# Altium project e-puck3-coreboard.PrjPcb (part 3 of 4)

## Sheet Main_uC.SchDoc: Main microcontroller
size A3; Organization: Use Organization_Name in ProjParam; Address1: Eliot Ferragni; Address2: STI-MOBOTS; Address3: EPFL; Address4: CH-1015 LAUSANNE; DocumentNumber: 2; Revision: A; SheetNumber: 2; SheetTotal: 11; ApprovedBy: Init ApprovedBy in DocParam; CheckedBy: Init CheckedBy in DocParam; Author: Init Author in DocParam; CompanyName: Init CompanyName in DocParam; DrawnBy: Init DrawBy in DocParam; Engineer: Init Engineer in DocParam; Title2: Main microcontroller + user's buttons; DocumentName: Init DocumentName in DocParam; ProjectName: Init ProjectName in DocParam
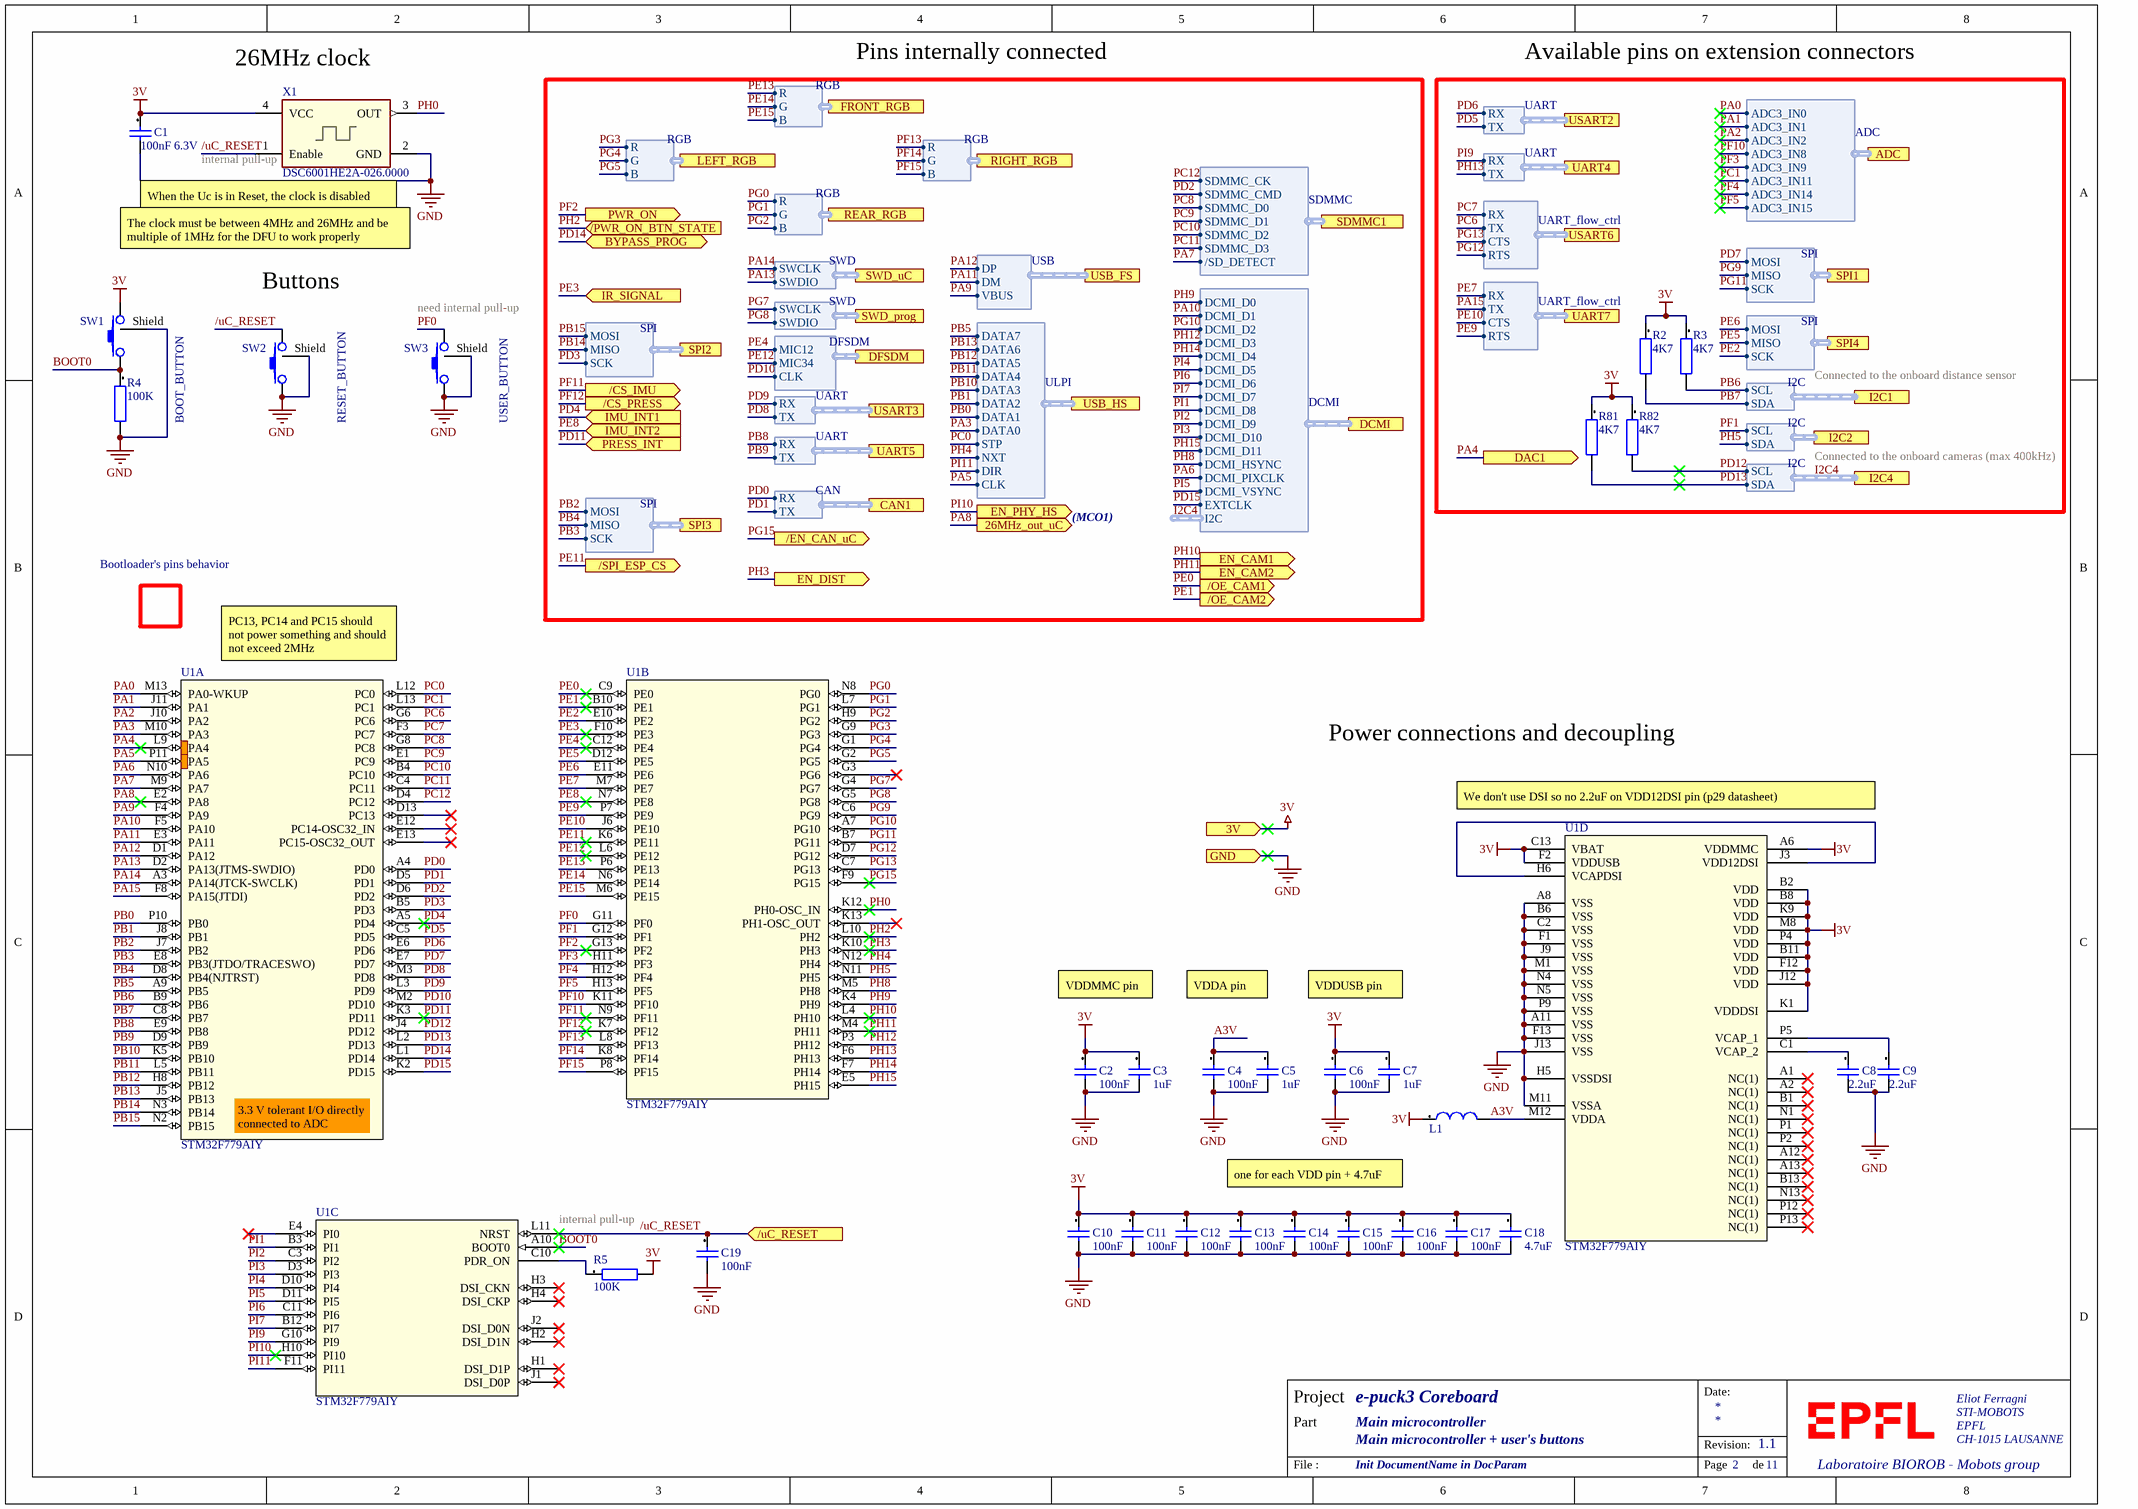
[diagram p7: Main_uC.SchDoc]

### Parts
(Parts that share a designator on the sheet are numbered #1, #2 ... from top to bottom, then left to right.)
C1  100nF 6.3V  [CAPC0201(0603)33_L]
C2  100nF  [CAPC0201(0603)33_L]
C3  1uF  [CAPC0201(0603)33_L]
C4  100nF  [CAPC0201(0603)33_L]
C5  1uF  [CAPC0201(0603)33_L]
C6  100nF  [CAPC0201(0603)33_L]
C7  1uF  [CAPC0201(0603)33_L]
C8  2.2uF  [CAPC0201(0603)33_L]
C9  2.2uF  [CAPC0201(0603)33_L]
C10  100nF  [CAPC0201(0603)33_L]
C11  100nF  [CAPC0201(0603)33_L]
C12  100nF  [CAPC0201(0603)33_L]
C13  100nF  [CAPC0201(0603)33_L]
C14  100nF  [CAPC0201(0603)33_L]
C15  100nF  [CAPC0201(0603)33_L]
C16  100nF  [CAPC0201(0603)33_L]
C17  100nF  [CAPC0201(0603)33_L]
C18  4.7uF  [CAPC0201(0603)33_L]
C19  100nF  [CAPC0201(0603)33_L]
L1  MMZ1005S601HT000  [0402 inductor]  (value not drawn)
R2  4K7  [RESC0201(0603)_L]
R3  4K7  [RESC0201(0603)_L]
R4  100K  [RESC0201(0603)_L]
R5#2  100K  [RESC0201(0603)_L]
R81  4K7  [RESC0201(0603)_L]
R82#2  4K7  [RESC0201(0603)_L]
SW1  button  [C&K_KMR2]  (value not drawn)
SW2  button  [C&K_KMR2]  (value not drawn)
SW3  button  [C&K_KMR2]  (value not drawn)
U1  STM32F779AIY  [WLCSP-180]  (parts A,B,C,D of 4)
X1  DSC6001HE2A-026.0000  [Oscillator 1.6x1.2mm VFLGA]

### Blocks framed on the sheet
Available pins on extension connectors: R2 R3 R81 R82#2

### Ports
3V (in), 26MHz_out_uC (out), /CS_IMU (out), /CS_PRESS (out), /EN_CAN_uC (out), /OE_CAM1 (out), /OE_CAM2 (out), /PWR_ON_BTN_STATE (in), /SPI_ESP_CS (out), /uC_RESET (in), ADC (harness ADC), BYPASS_PROG (bidir), CAN1 (harness CAN), DAC1 (out), DCMI (harness DCMI), DFSDM (harness DFSDM), EN_CAM1 (out), EN_CAM2 (out), EN_DIST (out), EN_PHY_HS (out), FRONT_RGB (harness RGB), GND (in), I2C1 (harness I2C), I2C2 (harness I2C), I2C4 (harness I2C), IMU_INT1 (in), IMU_INT2 (in), IR_SIGNAL (in), LEFT_RGB (harness RGB), PRESS_INT (in), PWR_ON (out), REAR_RGB (harness RGB), RIGHT_RGB (harness RGB), SDMMC1 (harness SDMMC), SPI1 (harness SPI), SPI2 (harness SPI), SPI3 (harness SPI), SPI4 (harness SPI), SWD_prog (harness SWD), SWD_uC (harness SWD), UART4 (harness UART), UART5 (harness UART), UART7 (harness UART_flow_ctrl), USART2 (harness UART), USART3 (harness UART), USART6 (harness UART_flow_ctrl), USB_FS (harness USB), USB_HS (harness ULPI)

### Harnesses
SWD: SWDIO, SWCLK
I2C: SDA, SCL
CAN: TX, RX
USB: DM, DP, VBUS
UART: RX, TX
RGB: R, G, B
DFSDM: MIC34, MIC12, CLK
DCMI: DCMI_D0, DCMI_D1, DCMI_D2, DCMI_D3, DCMI_D4, DCMI_D5, DCMI_D6, DCMI_D7, DCMI_D8, DCMI_D9, DCMI_D10, DCMI_D11, DCMI_HSYNC, DCMI_PIXCLK, DCMI_VSYNC, I2C, EXTCLK
SDMMC: SDMMC_CK, SDMMC_CMD, SDMMC_D0, SDMMC_D1, SDMMC_D2, SDMMC_D3, /SD_DETECT
SPI: MISO, MOSI, SCK
UART_flow_ctrl: RX, TX, CTS, RTS
ADC: ADC3_IN0, ADC3_IN1, ADC3_IN2, ADC3_IN8, ADC3_IN9, ADC3_IN11, ADC3_IN14, ADC3_IN15
ULPI: DATA7, DATA6, DATA5, DATA4, DATA3, DATA2, DATA1, DATA0, STP, NXT, DIR, CLK

### Nets
3V: C1.1 C2.1 C3.1 C6.1 C7.1 C10.1 C11.1 C12.1 C13.1 C14.1 C15.1 C16.1 C17.1 C18.1 L1.1 R2.1 R3.1 R5#2.2 R81.1 R82#2.1 SW1.2 U1.A6(VDDMMC) U1.B2(VDD) U1.B8(VDD) U1.B11(VDD) U1.C13(VBAT) U1.F2(VDDUSB) U1.F12(VDD) U1.J12(VDD) U1.K1(VDDDSI) U1.K9(VDD) U1.M8(VDD) U1.P4(VDD) X1.4(VCC) ; port 3V
GND: C1.2 C2.2 C3.2 C4.2 C5.2 C6.2 C7.2 C8.2 C9.2 C10.2 C11.2 C12.2 C13.2 C14.2 C15.2 C16.2 C17.2 C18.2 C19.2 R4.2 SW1.Shield SW2.1 SW2.Shield SW3.1 SW3.Shield U1.A8(VSS) U1.A11(VSS) U1.B6(VSS) U1.C2(VSS) U1.F1(VSS) U1.F13(VSS) U1.H5(VSSDSI) U1.J9(VSS) U1.J13(VSS) U1.M1(VSS) U1.M11(VSSA) U1.N4(VSS) U1.N5(VSS) U1.P9(VSS) X1.2(GND) ; port GND
/uC_RESET: C19.1 SW2.2 U1.L11(NRST) X1.1(Enable) ; port /uC_RESET
A3V: C4.1 C5.1 L1.2 U1.M12(VDDA)  [project net A3V_2]
BOOT0: R4.1 SW1.1 U1.A10(BOOT0)  [project net BOOT0_2]
PA0: U1.M13(PA0-WKUP) ; port ADC.ADC3_IN0  [project net ADC.ADC3_IN0]
PA1: U1.J11(PA1) ; port ADC.ADC3_IN1  [project net ADC.ADC3_IN1]
PA2: U1.J10(PA2) ; port ADC.ADC3_IN2  [project net ADC.ADC3_IN2]
PA3: U1.M10(PA3) ; port USB_HS.DATA0  [project net USB_HS.DATA0]
PA4: U1.L9(PA4) ; port DAC1  [project net DAC1]
PA5: U1.P11(PA5) ; port USB_HS.CLK  [project net USB_HS.CLK]
PA6: U1.N10(PA6) ; port DCMI.DCMI_PIXCLK  [project net DCMI.DCMI_PIXCLK]
PA7: U1.M9(PA7) ; port SDMMC1./SD_DETECT  [project net SDMMC./SD_DETECT]
PA8: U1.E2(PA8) ; port 26MHz_out_uC  [project net 26MHz_PHY_HS]
PA9: U1.F4(PA9) ; port USB_FS.VBUS  [project net USB_FS.VBUS]
PA10: U1.F5(PA10) ; port DCMI.DCMI_D1  [project net DCMI.DCMI_D1]
PA11: U1.E3(PA11) ; port USB_FS.DM  [project net USB_FS.DM]
PA12: U1.D1(PA12) ; port USB_FS.DP  [project net USB_FS.DP]
PA13: U1.D2(PA13(JTMS-SWDIO)) ; port SWD_uC.SWDIO  [project net SWD_uC.SWDIO]
PA14: U1.A3(PA14(JTCK-SWCLK)) ; port SWD_uC.SWCLK  [project net SWD_uC.SWCLK]
PA15: U1.F8(PA15(JTDI)) ; port UART7.TX  [project net UART7.TX]
PB0: U1.P10(PB0) ; port USB_HS.DATA1  [project net USB_HS.DATA1]
PB1: U1.J8(PB1) ; port USB_HS.DATA2  [project net USB_HS.DATA2]
PB2: U1.J7(PB2) ; port SPI3.MOSI  [project net SPI3.MOSI]
PB3: U1.E8(PB3(JTDO/TRACESWO)) ; port SPI3.SCK  [project net SPI3.SCK]
PB4: U1.D8(PB4(NJTRST)) ; port SPI3.MISO  [project net SPI3.MISO]
PB5: U1.A9(PB5) ; port USB_HS.DATA7  [project net USB_HS.DATA7]
PB6: R3.2 U1.B9(PB6) ; port I2C1.SCL  [project net I2C1.SCL]
PB7: R2.2 U1.C8(PB7) ; port I2C1.SDA  [project net I2C1.SDA]
PB8: U1.E9(PB8) ; port UART5.RX  [project net UART5_uC.RX]
PB9: U1.D9(PB9) ; port UART5.TX  [project net UART2_ESP32.RX]
PB10: U1.K5(PB10) ; port USB_HS.DATA3  [project net USB_HS.DATA3]
PB11: U1.L5(PB11) ; port USB_HS.DATA4  [project net USB_HS.DATA4]
PB12: U1.H8(PB12) ; port USB_HS.DATA5  [project net USB_HS.DATA5]
PB13: U1.J5(PB13) ; port USB_HS.DATA6  [project net USB_HS.DATA6]
PB14: U1.N3(PB14) ; port SPI2.MISO  [project net SPI2.MISO]
PB15: U1.N2(PB15) ; port SPI2.MOSI  [project net SPI2.MOSI]
PC0: U1.L12(PC0) ; port USB_HS.STP  [project net USB_HS.STP]
PC1: U1.L13(PC1) ; port ADC.ADC3_IN11  [project net ADC.ADC3_IN11]
PC6: U1.G6(PC6) ; port USART6.TX  [project net USART6.TX]
PC7: U1.F3(PC7) ; port USART6.RX  [project net USART6.RX]
PC8: U1.G8(PC8) ; port SDMMC1.SDMMC_D0  [project net SDMMC.SDMMC_D0]
PC9: U1.E1(PC9) ; port SDMMC1.SDMMC_D1  [project net SDMMC.SDMMC_D1]
PC10: U1.B4(PC10) ; port SDMMC1.SDMMC_D2  [project net SDMMC.SDMMC_D2]
PC11: U1.C4(PC11) ; port SDMMC1.SDMMC_D3  [project net SDMMC.SDMMC_D3]
PC12: U1.D4(PC12) ; port SDMMC1.SDMMC_CK  [project net SDMMC.SDMMC_CK]
PD0: U1.A4(PD0) ; port CAN1.RX  [project net CAN1.RX]
PD1: U1.D5(PD1) ; port CAN1.TX  [project net CAN1.TX]
PD2: U1.D6(PD2) ; port SDMMC1.SDMMC_CMD  [project net SDMMC.SDMMC_CMD]
PD3: U1.B5(PD3) ; port SPI2.SCK  [project net SPI2.SCK]
PD4: U1.A5(PD4) ; port IMU_INT1  [project net IMU_INT1]
PD5: U1.C5(PD5) ; port USART2.TX  [project net USART2.TX]
PD6: U1.E6(PD6) ; port USART2.RX  [project net USART2.RX]
PD7: U1.E7(PD7) ; port SPI1.MOSI  [project net SPI1.MOSI]
PD8: U1.M3(PD8) ; port USART3.TX  [project net USART3.TX]
PD9: U1.L3(PD9) ; port USART3.RX  [project net USART3.RX]
PD10: U1.M2(PD10) ; port DFSDM.CLK  [project net DFSDM.CLK]
PD11: U1.K3(PD11) ; port PRESS_INT  [project net PRESS_INT]
PD12: R82#2.2 U1.J4(PD12) ; port I2C4.SCL  [project net I2C4.SCL]
PD13: R81.2 U1.L2(PD13) ; port I2C4.SDA  [project net I2C4.SDA]
PD14: U1.L1(PD14) ; port BYPASS_PROG  [project net BYPASS_PROG]
PD15: U1.K2(PD15) ; port DCMI.EXTCLK  [project net DCMI.EXTCLK]
PE0: U1.C9(PE0) ; port /OE_CAM1  [project net /OE_CAM1]
PE1: U1.B10(PE1) ; port /OE_CAM2  [project net /OE_CAM2]
PE2: U1.E10(PE2) ; port SPI4.SCK  [project net SPI1.SCK]
PE3: U1.F10(PE3) ; port IR_SIGNAL  [project net IR_SIGNAL]
PE4: U1.C12(PE4) ; port DFSDM.MIC12  [project net DFSDM.MIC12]
PE5: U1.D12(PE5) ; port SPI4.MISO  [project net SPI1.MISO]
PE6: U1.E11(PE6) ; port SPI4.MOSI  [project net SPI1.MOSI]
PE7: U1.M7(PE7) ; port UART7.RX  [project net UART7.RX]
PE8: U1.N7(PE8) ; port IMU_INT2  [project net IMU_INT2]
PE9: U1.P7(PE9) ; port UART7.RTS  [project net UART7.RTS]
PE10: U1.J6(PE10) ; port UART7.CTS  [project net UART7.CTS]
PE11: U1.K6(PE11) ; port /SPI_ESP_CS  [project net /SPI_ESP_CS]
PE12: U1.L6(PE12) ; port DFSDM.MIC34  [project net DFSDM.MIC34]
PE13: U1.P6(PE13) ; port FRONT_RGB.R  [project net FRONT_RGB.R]
PE14: U1.N6(PE14) ; port FRONT_RGB.G  [project net FRONT_RGB.G]
PE15: U1.M6(PE15) ; port FRONT_RGB.B  [project net FRONT_RGB.B]
PF0: SW3.2 U1.G11(PF0)  [project net PF0_2]
PF1: U1.G12(PF1) ; port I2C2.SCL  [project net I2C2.SCL]
PF2: U1.G13(PF2) ; port PWR_ON  [project net PWR_ON]
PF3: U1.H11(PF3) ; port ADC.ADC3_IN9  [project net ADC.ADC3_IN9]
PF4: U1.H12(PF4) ; port ADC.ADC3_IN14  [project net ADC.ADC3_IN14]
PF5: U1.H13(PF5) ; port ADC.ADC3_IN15  [project net ADC.ADC3_IN15]
PF10: U1.K11(PF10) ; port ADC.ADC3_IN8  [project net ADC.ADC3_IN8]
PF11: U1.N9(PF11) ; port /CS_IMU  [project net /CS_IMU]
PF12: U1.K7(PF12) ; port /CS_PRESS  [project net /CS_PRESS]
PF13: U1.L8(PF13) ; port RIGHT_RGB.R  [project net RIGHT_RGB.R]
PF14: U1.K8(PF14) ; port RIGHT_RGB.G  [project net RIGHT_RGB.G]
PF15: U1.P8(PF15) ; port RIGHT_RGB.B  [project net RIGHT_RGB.B]
PG0: U1.N8(PG0) ; port REAR_RGB.R  [project net REAR_RGB.R]
PG1: U1.L7(PG1) ; port REAR_RGB.G  [project net REAR_RGB.G]
PG2: U1.H9(PG2) ; port REAR_RGB.B  [project net REAR_RGB.B]
PG3: U1.G9(PG3) ; port LEFT_RGB.R  [project net LEFT_RGB.R]
PG4: U1.G1(PG4) ; port LEFT_RGB.G  [project net LEFT_RGB.G]
PG5: U1.G2(PG5) ; port LEFT_RGB.B  [project net LEFT_RGB.B]
PG7: U1.G4(PG7) ; port SWD_prog.SWCLK  [project net SWD_prog.SWCLK]
PG8: U1.G5(PG8) ; port SWD_prog.SWDIO  [project net SWD_prog.SWDIO]
PG9: U1.C6(PG9) ; port SPI1.MISO  [project net SPI1.MISO]
PG10: U1.A7(PG10) ; port DCMI.DCMI_D2  [project net DCMI.DCMI_D2]
PG11: U1.B7(PG11) ; port SPI1.SCK  [project net SPI1.SCK]
PG12: U1.D7(PG12) ; port USART6.RTS  [project net USART6.RTS]
PG13: U1.C7(PG13) ; port USART6.CTS  [project net USART6.CTS]
PG15: U1.F9(PG15) ; port /EN_CAN_uC  [project net /EN_CAN_uC]
PH0: U1.K12(PH0-OSC_IN) X1.3(OUT)  [project net PH0_2]
PH2: U1.L10(PH2) ; port /PWR_ON_BTN_STATE  [project net /PWR_ON_BTN_STATE]
PH3: U1.K10(PH3) ; port EN_DIST  [project net EN_DIST]
PH4: U1.N12(PH4) ; port USB_HS.NXT  [project net USB_HS.NXT]
PH5: U1.N11(PH5) ; port I2C2.SDA  [project net I2C2.SDA]
PH8: U1.M5(PH8) ; port DCMI.DCMI_HSYNC  [project net DCMI.DCMI_HSYNC]
PH9: U1.K4(PH9) ; port DCMI.DCMI_D0  [project net DCMI.DCMI_D0]
PH10: U1.L4(PH10) ; port EN_CAM1  [project net EN_CAM1]
PH11: U1.M4(PH11) ; port EN_CAM2  [project net EN_CAM2]
PH12: U1.P3(PH12) ; port DCMI.DCMI_D3  [project net DCMI.DCMI_D3]
PH13: U1.F6(PH13) ; port UART4.TX  [project net UART4.TX]
PH14: U1.F7(PH14) ; port DCMI.DCMI_D4  [project net DCMI.DCMI_D4]
PH15: U1.E5(PH15) ; port DCMI.DCMI_D11  [project net DCMI.DCMI_D11]
PI1: U1.B3(PI1) ; port DCMI.DCMI_D8  [project net DCMI.DCMI_D8]
PI2: U1.C3(PI2) ; port DCMI.DCMI_D9  [project net DCMI.DCMI_D9]
PI3: U1.D3(PI3) ; port DCMI.DCMI_D10  [project net DCMI.DCMI_D10]
PI4: U1.D10(PI4) ; port DCMI.DCMI_D5  [project net DCMI.DCMI_D5]
PI5: U1.D11(PI5) ; port DCMI.DCMI_VSYNC  [project net DCMI.DCMI_VSYNC]
PI6: U1.C11(PI6) ; port DCMI.DCMI_D6  [project net DCMI.DCMI_D6]
PI7: U1.B12(PI7) ; port DCMI.DCMI_D7  [project net DCMI.DCMI_D7]
PI9: U1.G10(PI9) ; port UART4.RX  [project net UART4.RX]
PI10: U1.H10(PI10) ; port EN_PHY_HS  [project net /EN_PHY_HS]
PI11: U1.F11(PI11) ; port USB_HS.DIR  [project net USB_HS.DIR]
NetC8_1: C8.1 U1.C1(VCAP_2)
NetC9_1: C9.1 U1.P5(VCAP_1)
NetR5#2_1: R5#2.1 U1.C10(PDR_ON)
NetU1_H6: U1.H6(VCAPDSI) U1.J3(VDD12DSI)

Not connected (* = marked no-connect by the designer): U1 A1(NC(1))* A2(NC(1))* A12(NC(1))* A13(NC(1))* B1(NC(1))* B13(NC(1))* D13(PC13)* E4(PI0)* E12(PC14-OSC32_IN)* E13(PC15-OSC32_OUT)* G3(PG6)* H1(DSI_D1P)* H2(DSI_D1N)* H3(DSI_CKN)* H4(DSI_CKP)* J1(DSI_D0P)* J2(DSI_D0N)* K13(PH1-OSC_OUT)* N1(NC(1))* N13(NC(1))* P1(NC(1))* P2(NC(1))* P12(NC(1))* P13(NC(1))*

### Buses and harness runs
harness I2C4 = port I2C4

### Notes on the sheet
- (near X1) 26MHz clock
- Pins internally connected
- (near X1) internal pull-up
- The clock must be between 4MHz and 26MHz and be multiple of 1MHz for the DFU to work properly
- When the Uc is in Reset, the clock is disabled
- (near SW2) Buttons
- (near SW3) need internal pull-up
- Connected to the onboard distance sensor
- BOOT_BUTTON
- RESET_BUTTON
- USER_BUTTON
- Connected to the onboard cameras (max 400kHz)
- Bootloader's pins behavior
- (MCO1)
- (near U1) PC13, PC14 and PC15 should not power something and should not exceed 2MHz
- Power connections and decoupling
- (near U1) We don't use DSI so no 2.2uF on VDD12DSI pin (p29 datasheet)
- VDDMMC pin
- VDDA pin
- VDDUSB pin
- (near U1) Bootloader's pins behavior :
  USART1 :
  PA10 (RX) set as input 		-> connected to DCMI_D1						=> OK
  PA9 (TX) set as output high		-> connected to VBUS_DEVICES					=> problem if VBUS_DEVICES is low -> Serial Resistance
  USART3:
  PB11 (RX) set as input		-> connected to ULPI_D4						=> OK because the HS Phy is turned OFF if we are in the BOOTLOADER (pins are in Tri-State)
  PB10 (TX) set as output high		-> connected to ULPI_D3						=> OK because the HS Phy is turned OFF if we are in the BOOTLOADER (pins are in Tri-State)
  PC11 (RX) set as input		-> connected to SDMMC_D3						=> OK (sd card can connect it to VCC with a 50k resistor)
  PC10 (TX) set as output high		-> connected to SDMMC_D2						=> OK (sd card is input floating unless a SET_BUS_WIDTH is received)
  CAN2 (slave):
  PB5 (RX) set as input			-> connected to ULPI_D7						=> OK
  PB13 (TX) set as output high		-> connected to ULPI_D6						=> OK because the HS Phy is turned OFF if we are in the BOOTLOADER (pins are in Tri-State)
  I2C1 (slave):
  PB6 (SCL) set as open-drain		-> connected to I2C1 SCL						=> OK
  PB9 (SDA) set as open-drain		-> connected to UART5 TX						=> OK
  I2C2 (slave):
  PF1 (SCL) set as open-drain		-> connected to I2C2 SCL						=> OK
  PF0 (SDA) set as open-drain		-> connected to USER_BUTTON					=> OK
  I2C3 (slave):
  PA8 (SCL) set as open-drain		-> connected to REFCLK of HS Phy					=> OK
  PC9 (SDA) set as open-drain		-> connected to SDMMC_D1						=> OK
  SPI1 (slave):
  PA7 (MOSI) set as input pull-down	-> connected to SDMMC_DET						=> OK
  PA6 (MISO) set as output pull-down	-> connected to DCMI_PIXCLK						=> OK because camera is off if we are in BOOTLOADER
  PA5 (SCK) set as input pull-down	-> connected to ULPI_CK						=> OK (pull-down is around 40k)
  PA4 (NSS) set as input pull-up		-> connected to DAC_OUT1						=> OK
  SPI2 (slave):
  PI3 (MOSI) set as input pull-down	-> connected to DCMI_D10						=> OK (pull-down is around 40k)
  PI2 (MISO) set as output pull-down	-> connected to DCMI_D9						=> OK because camera is off if we are in BOOTLOADER
  PI1 (SCK) set as input pull-down		-> connected to DCMI_D8						=> OK (pull-down is around 40k)
  PI0 (NSS) set as input pull-up		-> connected to DCMI_D13						=> OK (pull-up is around 40k)
  SPI4 (slave):
  PE14 (MOSI) set as input pull-down	-> connected FRONT_RGB_G						=> OK
  PE13 (MISO) set as output pull-down	-> connected FRONT_RGB_R						=> OK
  PE12 (SCK) set as input pull-down	-> connected to MIC34						=> OK because the microphones won't send anything if not clocked
  PE11 (NSS) set as input pull-up		-> connected to /SPI_ESP_CS						=> OK
  USB (DFU):
  PA11 (DM)			-> connected to DM of the USB hub					=> OK
  PA12 (DP) (no pull-up needed)		-> connected to DP of the USB hub					=> OK
- one for each VDD pin + 4.7uF
- internal pull-up
- Date:
- Project
- Part
- Revision:
- File :
- Page
- de
- (in symbol STM32F77XAXY, part A) 3.3 V tolerant I/O directly connected to ADC

### Library data of the parts
C1-C19 = TBD Capacitor[[/\]]0201[[/\]]1: as C67-C82 on sheet Sensors + CAN; Size: 0201; Footprint Acort: 0201; ROHS: True; DateLastUpdate: 2018-10-19 / 8:59:52 AM; Manufacturer: -; Manufacturer part number: -; Package / Case: Capacitor 0201
L1 = MMZ1005S601HT000: FERRITE BEAD 600 OHM 0402 1LN; Manufacturer: TDK; Type: SMD; Note: To buy by assembler; Supplier 1: Digi-Key; Stock 1: 33440; Pricing 1: 1 = 0,10000, 10 = 0,07300, 25 = 0,06600, 50 = 0,05940, 100 = 0,04360, 250 = 0,03168, 500 = 0,02904, 1000 = 0,02508, 5000 = 0,01980 (USD); RoHS: No; ComponentLink1URL: https://product.tdk.com/info/en/catalog/datasheets/beads_commercial_signal_mmz1005-h_en.pdf?src-supplier=Digi-Key; ComponentLink1Description: https://product.tdk.com/info/en/catalog/datasheets/beads_commercial_signal_mmz1005-h_en.pdf?src-supplier=Digi-Key; Supplier Part Number 1: 445-175172-1-ND; Manufacturer Part Number: MMZ1005S601HT000; Package / Case: Ferrite bead 0402
R2-R4 R5#2 R81 R82#2 = TBD[[/\]]0201[[/\]]1: Resistor 0201; Preference: 1; Currentie: CHF; Note: To buy by assembler; Size: 0201; Footprint Acort: 0201; ROHS: True; DateLastUpdate: 2018-10-19 / 9:06:49 AM; Type: SMD; Manufacturer: -; Manufacturer part number: -; Package / Case: Resistor 0201
SW1-SW3 = C&K KMR2: KMR221GLFS; Manufacturer: C&K; Manufacturer Nr: 7-188275-6; Preference: 1; Currentie: CHF; Quant_1: 10; Quant_2: 900; Circuit: SPST-NO; Switch Function: Off-Mom; Contact Rating @ Voltage: 0.05A @ 32VDC; Actuator Type: Standard; Actuator Height off PCB, from Pins: 1.90mm; Actuator Orientation: Top Actuated; Outline: 4.60mm x 2.80mm; Illumination: Non-Illuminated; Operating Force: 200gf; Switch Travel: 0.25mm; Mechanical Life: 200,000 Cycles; Note: To buy by assembler; Footprint Acort: ToDefine; ComponentLink1Description: Datasheet; ComponentLink1URL: http://ecommas.tycoelectronics.com/commerce/DocumentDelivery/DDEController?Action=showdoc&DocId=Customer+Drawing%7F188275%7FR%7Fpdf%7FEnglish%7FC_188275_R.pdf; Supplier: Farnell; Supplier Nr: 1056234; ComponentLink2Description: Farnell link; ComponentLink2URL: http://fr.farnell.com/jsp/displayProduct.jsp?sku=1056234; ROHS: True; Type: SMD; Orientation: Vertical; DateLastUpdate: 2007-12-04 / 09:15:57; Price_1: 1,1; Price_2: 0,924; Supplier 1: Digi-Key; Manufacturer Part Number: KMR221GLFS; Category: Switches; Stock 1: 20549; Pricing 1: 1=0.51, 10=0.493, 25=0.484, 50=0.4656, 100=0.4017, 250=0.3652, 500=0.34694, 1000=0.2739 (USD); Packaging: Cut Tape (CT); Mounting Type: Surface Mount; Termination Style: Gull Wing; Illumination Voltage (Nominal): -; Illumination Type, Color: -; Ingress Protection: -; Features: Grounding Pin; Actuator Material: -; Operating Temperature: -40°C ~ 85°C; ComponentLink3URL: http://www.ck-components.com/index.php?module=media&action=Display&cmpref=14414&lang=en&width=&height=&format=&alt=; ComponentLink3Description: http://www.ck-components.com/index.php?module=media&action=Display&cmpref=14414&lang=en&width=&height=&format=&alt=; Supplier Part Number 1: 401-1427-1-ND; Package / Case: SMD Button
U1 = STM32F77XAXY: High Performance 32bits microcontroler; Vendor: STMicroelectronics; C: Copyright (C) 2016 Accelerated Designs. All rights reserved; Note: To buy by assembler; Manufacturer_Part_Number: stm32f779aiy; Copyright: Copyright (C) 2016 Accelerated Designs. All rights reserved; RefDes: RefDes; Type: SMD; Value: Value; Manufacturer: STMicroelectronics; Manufacturer part number: STM32F779AIY; Package / Case: WLCSP-180
X1 = DSC6001HE2A-026.0000: 26MHz LVCMOS MEMS (Silicon) Oscillator  1.71 V ~ 3.63 V Enable/Disable; Manufacturer: Microchip; Note: To buy by assembler; Supplier 1: Digi-Key; Stock 1: 797; Pricing 1: 1 = 1,07000, 25 = 0,89600, 100 = 0,81370 (USD); RoHS: No; Supplier Part Number 1: DSC6001HE2A-026.0000-ND; Manufacturer Part Number: DSC6001HE2A-026.0000; Type: SMD; Package / Case: VFLGA-4

## Sheet Extension_Connectors.SchDoc: Extensions connectors
size A3; Organization: Use Organization_Name in ProjParam; Address1: Eliot Ferragni; Address2: STI-MOBOTS; Address3: EPFL; Address4: CH-1015 LAUSANNE; DocumentNumber: 11; Revision: A; SheetNumber: 11; SheetTotal: 11; ApprovedBy: Init ApprovedBy in DocParam; CheckedBy: Init CheckedBy in DocParam; Author: Init Author in DocParam; CompanyName: Init CompanyName in DocParam; DrawnBy: Init DrawBy in DocParam; Engineer: Init Engineer in DocParam; Title2: Top and bottom extension connectors; DocumentName: Init DocumentName in DocParam; ProjectName: Init ProjectName in DocParam
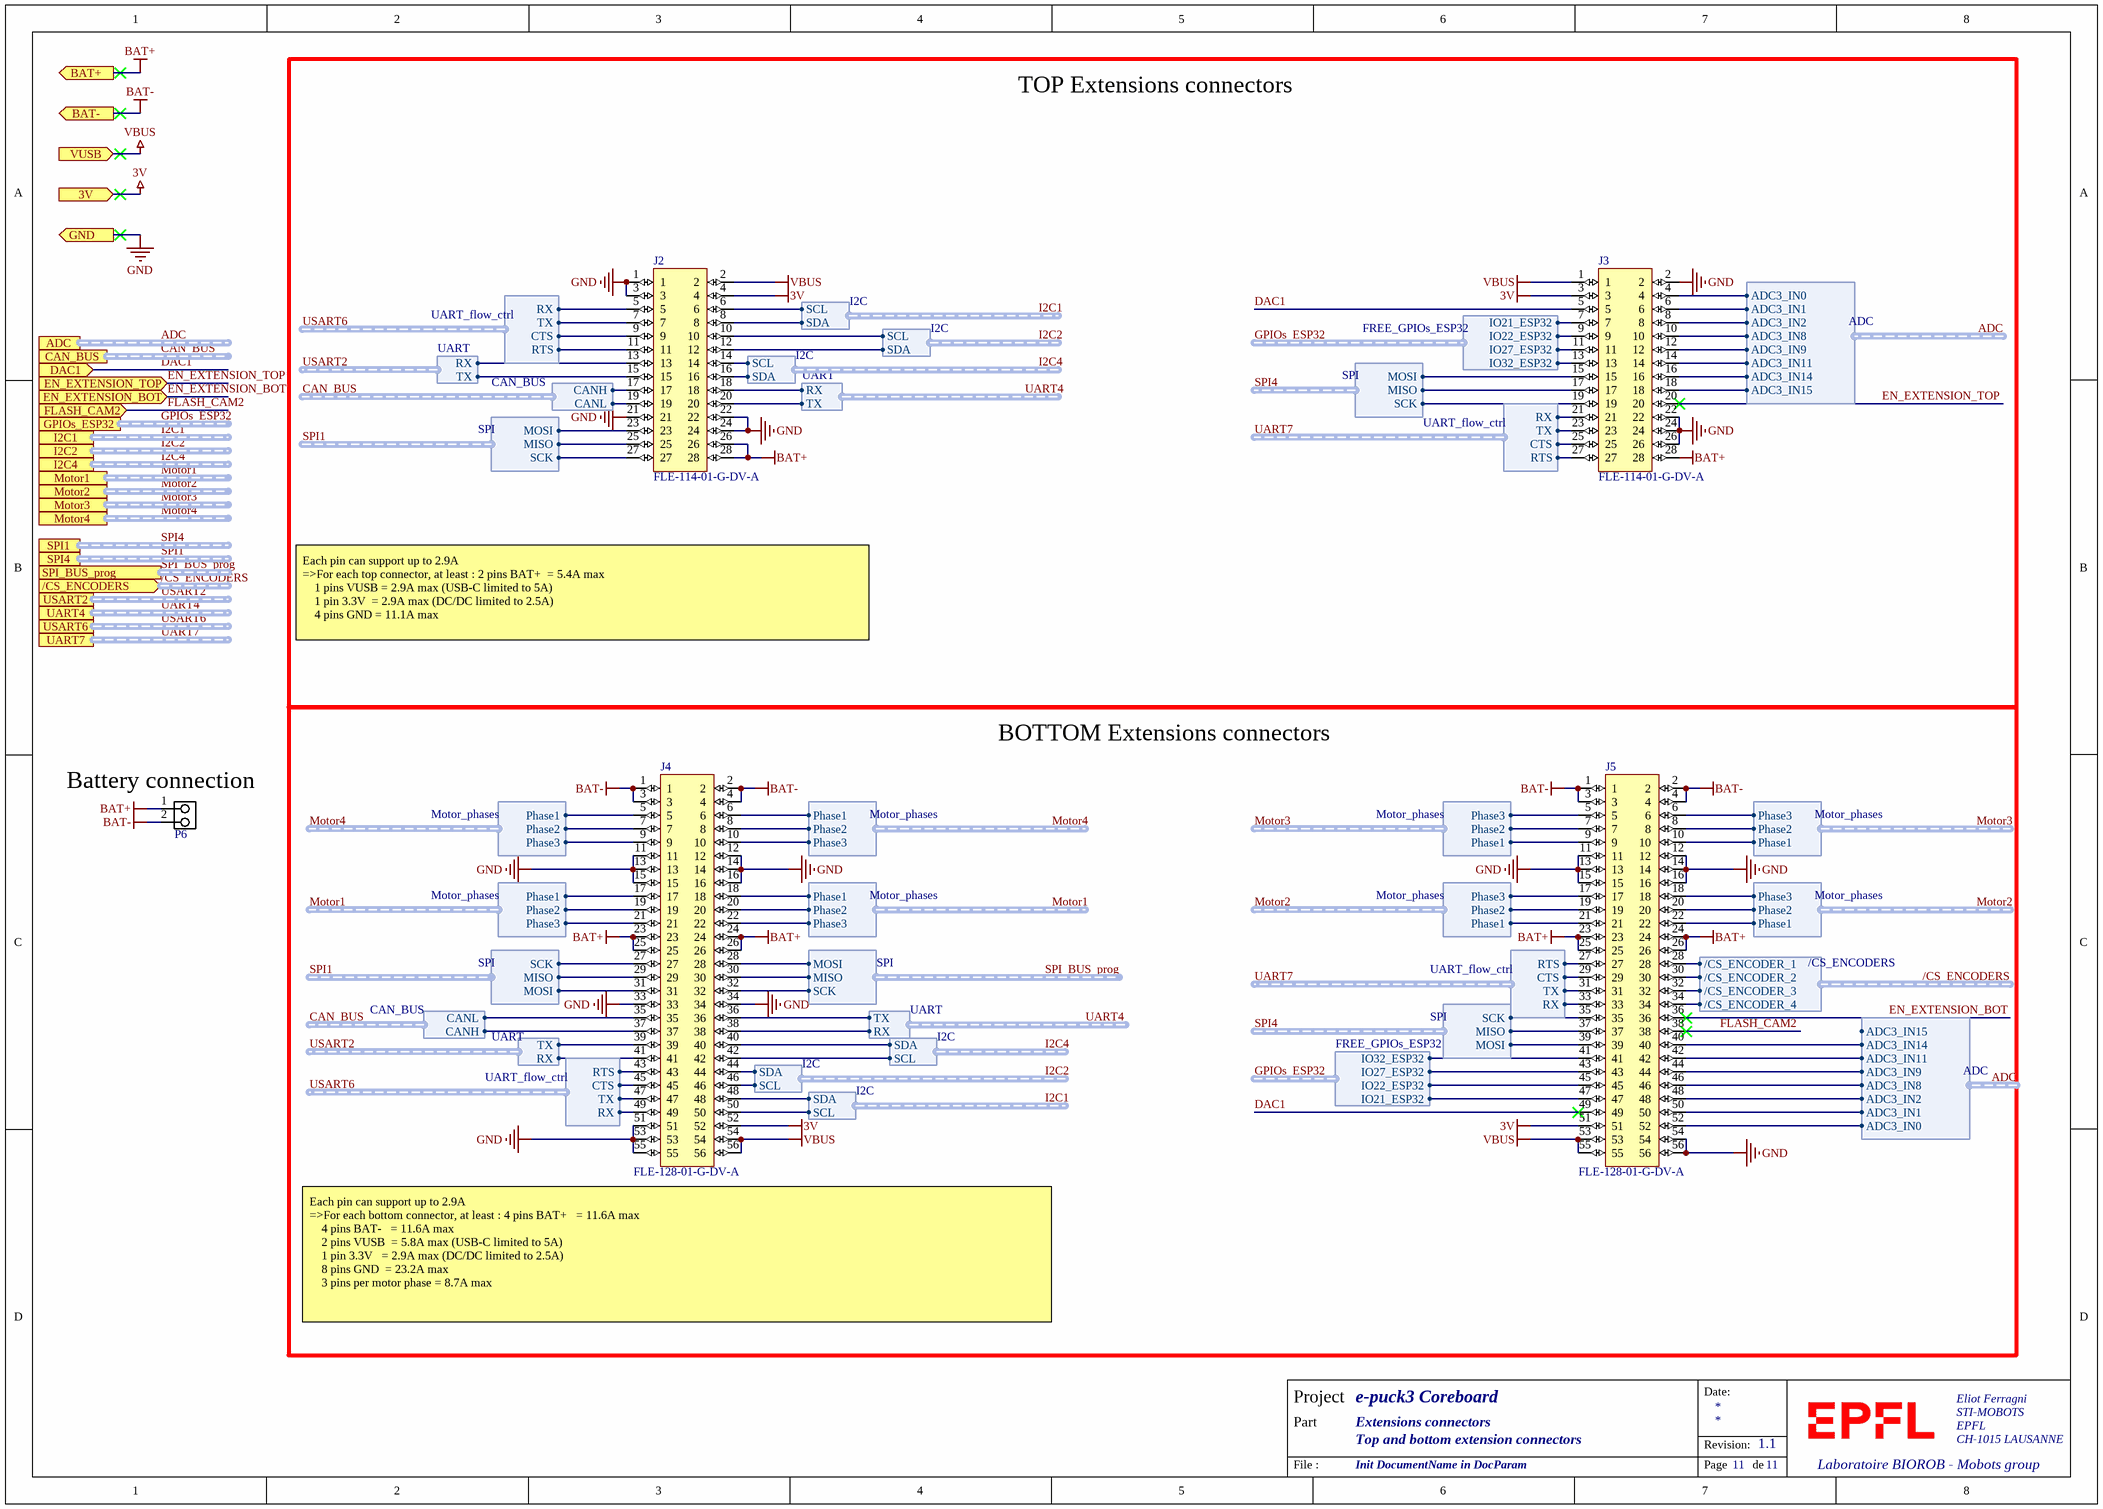
[diagram p8: Extension_Connectors.SchDoc]

### Parts
J2  FLE-114-01-G-DV-A  [FLE-114-01-G-DV-A]
J3  FLE-114-01-G-DV-A  [FLE-114-01-G-DV-A]
J4  FLE-128-01-G-DV-A  [FLE-128-01-G-DV-A]
J5  FLE-128-01-G-DV-A  [FLE-128-01-G-DV-A]
P6  2 power vias  [POWERVIAS_2]  (value not drawn)  (no BOM)

### Blocks framed on the sheet
TOP Extensions connectors: J2 J3
BOTTOM Extensions connectors: J4 J5

### Ports
3V (in), /CS_ENCODERS (in, harness /CS_ENCODERS), ADC (harness ADC), BAT+ (out), BAT- (out), CAN_BUS (harness CAN_BUS), DAC1 (in), EN_EXTENSION_BOT (in), EN_EXTENSION_TOP (in), FLASH_CAM2 (in), GND (out), GPIOs_ESP32 (harness FREE_GPIOs_ESP32), I2C1 (harness I2C), I2C2 (harness I2C), I2C4 (harness I2C), Motor1 (harness Motor_phases), Motor2 (harness Motor_phases), Motor3 (harness Motor_phases), Motor4 (harness Motor_phases), SPI1 (harness SPI), SPI4 (harness SPI), SPI_BUS_prog (harness SPI), UART4 (harness UART), UART7 (harness UART_flow_ctrl), USART2 (harness UART), USART6 (harness UART_flow_ctrl), VUSB (in)

### Harnesses
I2C: SDA, SCL
SPI: MISO, MOSI, SCK
UART_flow_ctrl: RX, TX, CTS, RTS
ADC: ADC3_IN0, ADC3_IN1, ADC3_IN2, ADC3_IN8, ADC3_IN9, ADC3_IN11, ADC3_IN14, ADC3_IN15
UART: RX, TX
CAN_BUS: CANL, CANH
/CS_ENCODERS: /CS_ENCODER_1, /CS_ENCODER_2, /CS_ENCODER_3, /CS_ENCODER_4
Motor_phases: Phase1, Phase2, Phase3
FREE_GPIOs_ESP32: IO22_ESP32, IO21_ESP32, IO27_ESP32, IO32_ESP32

### Nets
3V: J2.4 J3.3 J4.52 J5.51 ; port 3V
BAT+: J2.26 J2.28 J3.28 J4.23 J4.24 J4.25 J4.26 J5.23 J5.24 J5.25 J5.26 P6.1 ; port BAT+
BAT-: J4.1 J4.2 J4.3 J4.4 J5.1 J5.2 J5.3 J5.4 P6.2 ; port BAT-
GND: J2.1 J2.3 J2.21 J2.22 J2.24 J3.2 J3.22 J3.24 J3.26 J4.11 J4.12 J4.13 J4.14 J4.15 J4.16 J4.33 J4.34 J4.51 J4.53 J4.55 J5.11 J5.12 J5.13 J5.14 J5.15 J5.16 J5.54 J5.56 ; port GND
VBUS: J2.2 J3.1 J4.54 J4.56 J5.53 J5.55 ; port VUSB
/CS_ENCODERS./CS_ENCODER_1: J5.28 ; port /CS_ENCODERS./CS_ENCODER_1
/CS_ENCODERS./CS_ENCODER_2: J5.30 ; port /CS_ENCODERS./CS_ENCODER_2
/CS_ENCODERS./CS_ENCODER_3: J5.32 ; port /CS_ENCODERS./CS_ENCODER_3
/CS_ENCODERS./CS_ENCODER_4: J5.34 ; port /CS_ENCODERS./CS_ENCODER_4
ADC.ADC3_IN0: J3.4 J5.52 ; port ADC.ADC3_IN0
ADC.ADC3_IN1: J3.6 J5.50 ; port ADC.ADC3_IN1
ADC.ADC3_IN2: J3.8 J5.48 ; port ADC.ADC3_IN2
ADC.ADC3_IN8: J3.10 J5.46 ; port ADC.ADC3_IN8
ADC.ADC3_IN9: J3.12 J5.44 ; port ADC.ADC3_IN9
ADC.ADC3_IN11: J3.14 J5.42 ; port ADC.ADC3_IN11
ADC.ADC3_IN14: J3.16 J5.40 ; port ADC.ADC3_IN14
ADC.ADC3_IN15: J3.18 ; port ADC.ADC3_IN15
CAN_BUS.CANH: J2.17 J4.37 ; port CAN_BUS.CANH
CAN_BUS.CANL: J2.19 J4.35 ; port CAN_BUS.CANL
DAC1: J3.5 J5.49 ; port DAC1
EN_EXTENSION_BOT: J5.36 ; port EN_EXTENSION_BOT
EN_EXTENSION_TOP: J3.20 ; port EN_EXTENSION_TOP
FLASH_CAM2: J5.38 ; port FLASH_CAM2
FREE_GPIOs_ESP32.IO21_ESP32: J3.7 J5.47 ; port GPIOs_ESP32.IO21_ESP32
FREE_GPIOs_ESP32.IO22_ESP32: J3.9 J5.45 ; port GPIOs_ESP32.IO22_ESP32
FREE_GPIOs_ESP32.IO27_ESP32: J3.11 J5.43 ; port GPIOs_ESP32.IO27_ESP32
FREE_GPIOs_ESP32.IO32_ESP32: J3.13 J5.41 ; port GPIOs_ESP32.IO32_ESP32
I2C1.SCL: J2.6 J4.50 ; port I2C1.SCL
I2C1.SDA: J2.8 J4.48 ; port I2C1.SDA
I2C2.SCL: J2.10 J4.46 ; port I2C2.SCL
I2C2.SDA: J2.12 J4.44 ; port I2C2.SDA
I2C4.SCL: J2.14 J4.42 ; port I2C4.SCL
I2C4.SDA: J2.16 J4.40 ; port I2C4.SDA
Motor1.Phase1: J4.17 J4.18 ; port Motor1.Phase1
Motor1.Phase2: J4.19 J4.20 ; port Motor1.Phase2
Motor1.Phase3: J4.21 J4.22 ; port Motor1.Phase3
Motor2.Phase1: J5.21 J5.22 ; port Motor2.Phase1
Motor2.Phase2: J5.19 J5.20 ; port Motor2.Phase2
Motor2.Phase3: J5.17 J5.18 ; port Motor2.Phase3
Motor3.Phase1: J5.9 J5.10 ; port Motor3.Phase1
Motor3.Phase2: J5.7 J5.8 ; port Motor3.Phase2
Motor3.Phase3: J5.5 J5.6 ; port Motor3.Phase3
Motor4.Phase1: J4.5 J4.6 ; port Motor4.Phase1
Motor4.Phase2: J4.7 J4.8 ; port Motor4.Phase2
Motor4.Phase3: J4.9 J4.10 ; port Motor4.Phase3
SPI1.MISO: J2.25 J4.29 ; port SPI4.MISO
SPI1.MISO: J3.17 J5.37 ; port SPI1.MISO  [a separate net that carries the same name]
SPI1.MOSI: J3.15 J5.39 ; port SPI1.MOSI
SPI1.MOSI: J2.23 J4.31 ; port SPI4.MOSI  [a separate net that carries the same name]
SPI1.SCK: J2.27 J4.27 ; port SPI4.SCK
SPI1.SCK: J3.19 J5.35 ; port SPI1.SCK  [a separate net that carries the same name]
SPI_BUS.MISO: J4.30 ; port SPI_BUS_prog.MISO
SPI_BUS.MOSI: J4.28 ; port SPI_BUS_prog.MOSI
SPI_BUS.SCK: J4.32 ; port SPI_BUS_prog.SCK
UART4.RX: J2.18 J4.38 ; port UART4.RX
UART4.TX: J2.20 J4.36 ; port UART4.TX
UART7.CTS: J3.25 J5.29 ; port UART7.CTS
UART7.RTS: J3.27 J5.27 ; port UART7.RTS
UART7.RX: J3.21 J5.33 ; port UART7.RX
UART7.TX: J3.23 J5.31 ; port UART7.TX
USART2.RX: J2.13 J4.41 ; port USART2.RX
USART2.TX: J2.15 J4.39 ; port USART2.TX
USART6.CTS: J2.9 J4.45 ; port USART6.CTS
USART6.RTS: J2.11 J4.43 ; port USART6.RTS
USART6.RX: J2.5 J4.49 ; port USART6.RX
USART6.TX: J2.7 J4.47 ; port USART6.TX

### Buses and harness runs
harness /CS_ENCODERS = port /CS_ENCODERS
harness ADC = port ADC
harness CAN_BUS = port CAN_BUS
harness GPIOs_ESP32 = port GPIOs_ESP32
harness I2C1 = port I2C1
harness I2C2 = port I2C2
harness I2C4 = port I2C4
harness Motor1 = port Motor1
harness Motor2 = port Motor2
harness Motor3 = port Motor3
harness Motor4 = port Motor4
harness SPI1 = port SPI4
harness SPI4 = port SPI1
harness SPI_BUS_prog = port SPI_BUS_prog
harness UART4 = port UART4
harness UART7 = port UART7
harness USART2 = port USART2
harness USART6 = port USART6

### Notes on the sheet
- Each pin can support up to 2.9A
  =>For each top connector, at least :	2 pins BAT+ 	= 5.4A max
  1 pins VUSB	= 2.9A max (USB-C limited to 5A)
  1 pin 3.3V		= 2.9A max (DC/DC limited to 2.5A)
  4 pins GND	= 11.1A max
- (near P6) Battery connection
- (near J4) Each pin can support up to 2.9A
  =>For each bottom connector, at least :	4 pins BAT+ 		= 11.6A max
  4 pins BAT- 		= 11.6A max
  2 pins VUSB		= 5.8A max (USB-C limited to 5A)
  1 pin 3.3V			= 2.9A max (DC/DC limited to 2.5A)
  8 pins GND		= 23.2A max
  3 pins per motor phase	= 8.7A max
- Date:
- Project
- Part
- Revision:
- File :
- Page
- de

### Library data of the parts
J2 J3 = FLE-114-01-G-DV-A: .050 MICRO STRIPS; Manufacturer: Samtec; Number of Contacts: 28; Gender: Female; Pitch: 1.27mm; Note: To buy by assembler; Supplier 1: Digi-Key; Stock 1: 0; Pricing 1: 1 = 4,47000 (USD); RoHS: Yes; Contact Plating: Gold; Number of Rows: 2; Termination: Solder; ComponentLink1URL: http://suddendocs.samtec.com/prints/fle-1xx-xx-xx-dv-x-mkt.pdf?src-supplier=Digi-Key; ComponentLink1Description: http://suddendocs.samtec.com/prints/fle-1xx-xx-xx-dv-x-mkt.pdf?src-supplier=Digi-Key; ComponentLink2URL: http://cloud.samtec.com/catalog_english/FLE_SM.PDF?src-supplier=Avnet; ComponentLink2Description: http://cloud.samtec.com/catalog_english/FLE_SM.PDF?src-supplier=Avnet; Supplier Part Number 1: FLE-114-01-G-DV-A-ND; Manufacturer Part Number: FLE-114-01-G-DV-A; Type: SMD; Package / Case: Connector
J4 J5 = FLE-128-01-G-DV-A: .050 MICRO STRIPS; Manufacturer: Samtec; Number of Contacts: 56; Gender: Female; Contact Resistance: 15mR; Pitch: 1.27mm; Note: To buy by assembler; Supplier 1: Digi-Key; Stock 1: 0; Pricing 1: 125 = 5,40800 (USD); RoHS: Yes; Contact Plating: Gold; Contact Material: Bronze; Housing Color: Black; Housing Material: Polymer; Min Operating Temperature: -55°C; Max Operating Temperature: 125°C; Termination: Solder; Number of Rows: 2; Packaging: Tape and Reel; Orientation: Straight; Length: 35.67mm; Depth: 3.33mm; ComponentLink1URL: http://components.arrow.com/part/dataview/0323_04389637?src-supplier=Arrow+Europe; ComponentLink1Description: http://components.arrow.com/part/dataview/0323_04389637?src-supplier=Arrow+Europe; ComponentLink2URL: http://cloud.samtec.com/catalog_english/FLE_SM.PDF?src-supplier=Avnet; ComponentLink2Description: http://cloud.samtec.com/catalog_english/FLE_SM.PDF?src-supplier=Avnet; Supplier Part Number 1: FLE-128-01-G-DV-A-K-TR-ND; Manufacturer Part Number: FLE-128-01-G-DV-A; Type: SMD; Package / Case: Connector
P6 = 2 power vias: 2 Pins; Type: SMD

## Sheet ESC_2S-5S.SchDoc: Brushless motor driver
size A4; Organization: Use Organization_Name in ProjParam; Address1: Eliot Ferragni; Address2: STI-MOBOTS; Address3: EPFL; Address4: CH-1015 LAUSANNE; DocumentNumber: 5; Revision: A; SheetNumber: 5; SheetTotal: 11; ApprovedBy: Init ApprovedBy in DocParam; CheckedBy: Init CheckedBy in DocParam; Author: Init Author in DocParam; CompanyName: Init CompanyName in DocParam; DrawnBy: Init DrawBy in DocParam; Engineer: Init Engineer in DocParam; Title2: Half-bridges + phase sense circuit + connector; DocumentName: Init DocumentName in DocParam; ProjectName: Init ProjectName in DocParam
Used 4 times, as channels U1_ESC, U2_ESC, U3_ESC, U4_ESC. Parts and nets are listed once, with the designators drawn on the sheet.
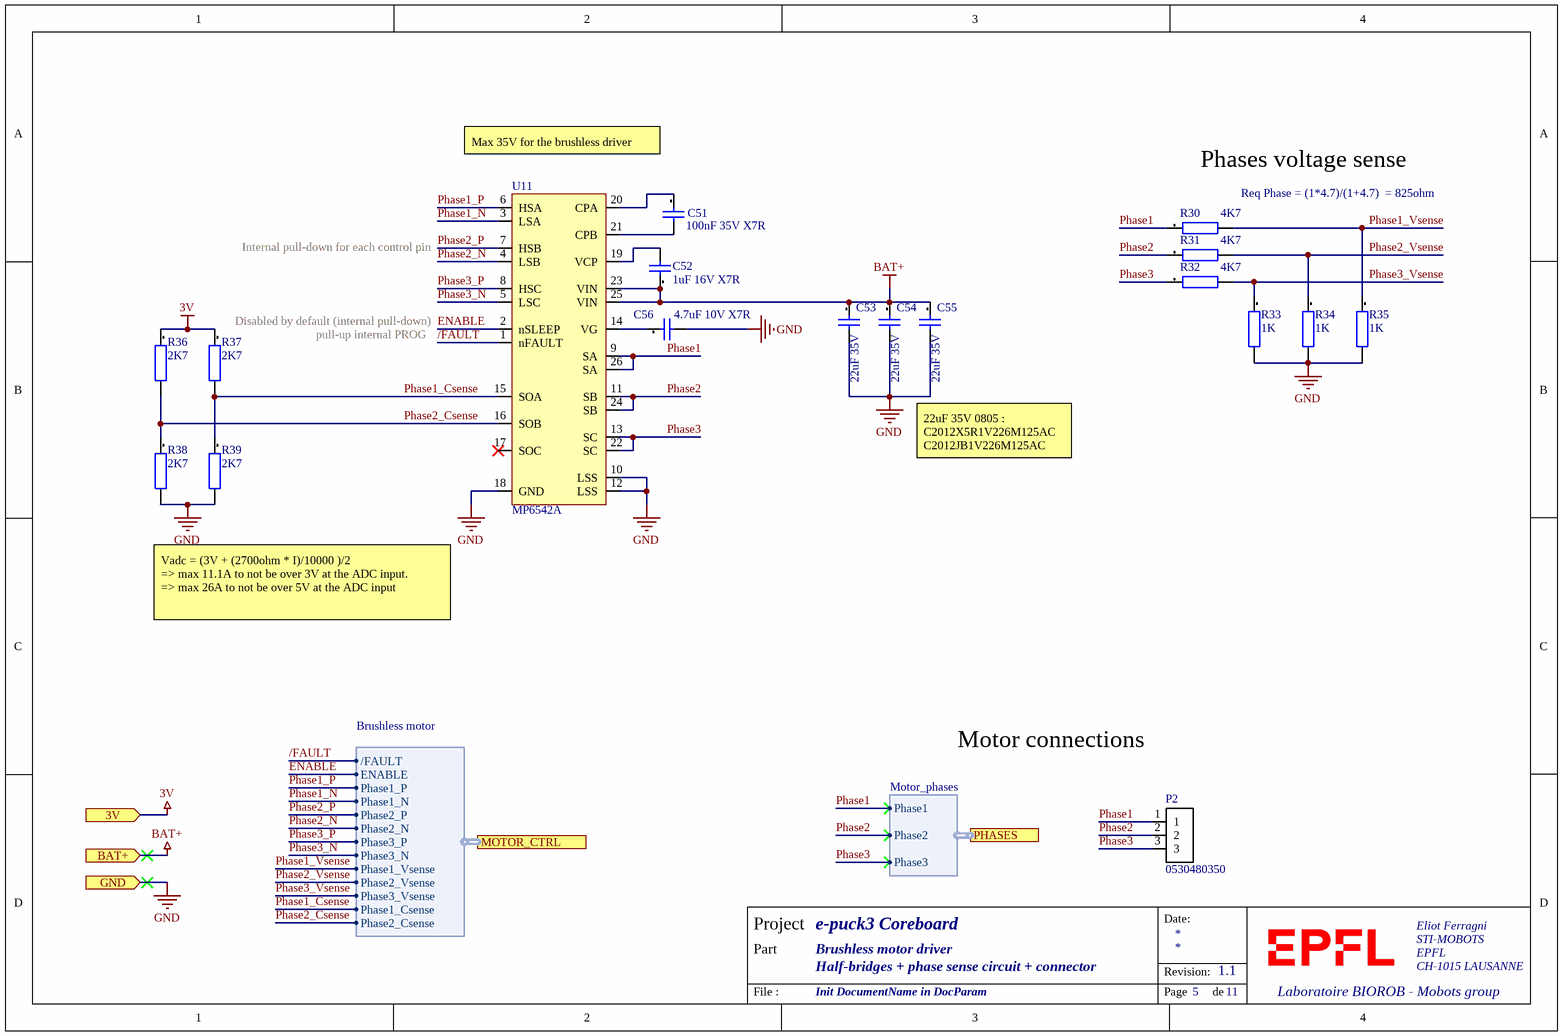
[diagram p9: ESC_2S-5S.SchDoc]

### Parts
C51  100nF 35V X7R  [CAPC1005X05L]
C52  1uF 16V X7R  [CAPC1608X08L]
C53  22uF 35V  [CAPC2012X13L]
C54  22uF 35V  [CAPC2012X13L]
C55  22uF 35V  [CAPC2012X13L]
C56  4.7uF 10V X7R  [CAPC2012X13L]
P2  0530480350  [0530480350]
R30  4K7  [RESC0201(0603)_L]
R31  4K7  [RESC0201(0603)_L]
R32  4K7  [RESC0201(0603)_L]
R33  1K  [RESC0201(0603)_L]
R34  1K  [RESC0201(0603)_L]
R35  1K  [RESC0201(0603)_L]
R36  2K7  [RESC0201(0603)_L]
R37  2K7  [RESC0201(0603)_L]
R38  2K7  [RESC0201(0603)_L]
R39  2K7  [RESC0201(0603)_L]
U11  MP6542A  [FCQFN6x6-26]

### Ports
3V (in), BAT+ (in), GND (in), MOTOR_CTRL (harness Brushless motor), PHASES (harness Motor_phases)

### Harnesses
Brushless motor: Phase1_P, Phase1_N, Phase2_P, Phase2_N, Phase3_P, Phase3_N, Phase1_Vsense, Phase2_Vsense, Phase3_Vsense, Phase1_Csense, ENABLE, /FAULT, Phase2_Csense
Motor_phases: Phase1, Phase2, Phase3

### Nets
3V: R36.1 R37.1 ; port 3V
BAT+: C52.1 C53.1 C54.1 C55.1 U11.23(VIN) U11.25(VIN) ; port BAT+
GND: C53.2 C54.2 C55.2 C56.2 R33.2 R34.2 R35.2 R38.2 R39.2 U11.10(LSS) U11.12(LSS) U11.18(GND) ; port GND
/FAULT: U11.1(nFAULT) ; port MOTOR_CTRL./FAULT
ENABLE: U11.2(nSLEEP) ; port MOTOR_CTRL.ENABLE
Phase1: P2.1 R30.1 U11.9(SA) U11.26(SA) ; port PHASES.Phase1
Phase1_Csense: R37.2 R39.1 U11.15(SOA) ; port MOTOR_CTRL.Phase1_Csense
Phase1_N: U11.3(LSA) ; port MOTOR_CTRL.Phase1_N
Phase1_P: U11.6(HSA) ; port MOTOR_CTRL.Phase1_P
Phase1_Vsense: R30.2 R35.1 ; port MOTOR_CTRL.Phase1_Vsense
Phase2: P2.2 R31.1 U11.11(SB) U11.24(SB) ; port PHASES.Phase2
Phase2_Csense: R36.2 R38.1 U11.16(SOB) ; port MOTOR_CTRL.Phase2_Csense
Phase2_N: U11.4(LSB) ; port MOTOR_CTRL.Phase2_N
Phase2_P: U11.7(HSB) ; port MOTOR_CTRL.Phase2_P
Phase2_Vsense: R31.2 R34.1 ; port MOTOR_CTRL.Phase2_Vsense
Phase3: P2.3 R32.1 U11.13(SC) U11.22(SC) ; port PHASES.Phase3
Phase3_N: U11.5(LSC) ; port MOTOR_CTRL.Phase3_N
Phase3_P: U11.8(HSC) ; port MOTOR_CTRL.Phase3_P
Phase3_Vsense: R32.2 R33.1 ; port MOTOR_CTRL.Phase3_Vsense
NetC51_1: C51.1 U11.20(CPA)
NetC51_2: C51.2 U11.21(CPB)
NetC52_2: C52.2 U11.19(VCP)
NetC56_1: C56.1 U11.14(VG)

Not connected (* = marked no-connect by the designer): U11 17(SOC)*

### Channels
U1_ESC: designators end in _1; ports 3V=3V BAT+=BAT+ GND=GND
U2_ESC: designators end in _2; ports 3V=3V BAT+=BAT+ GND=GND
U3_ESC: designators end in _3; ports 3V=3V BAT+=BAT+ GND=GND
U4_ESC: designators end in _4; ports 3V=3V BAT+=BAT+ GND=GND

### Notes on the sheet
- Max 35V for the brushless driver
- Phases voltage sense
- (near U11) Internal pull-down for each control pin
- (near R30) Req Phase = (1*4.7)/(1+4.7)  = 825ohm
- Disabled by default (internal pull-down)
- pull-up internal PROG
- 22uF 35V 0805 :
  C2012X5R1V226M125AC
  C2012JB1V226M125AC
- Vadc = (3V + (2700ohm * I)/10000 )/2
  => max 11.1A to not be over 3V at the ADC input.
  => max 26A to not be over 5V at the ADC input
- Motor connections
- Date:
- Project
- Part
- Revision:
- File :
- Page
- de

### Library data of the parts
C51 = TBD Capacitor[[/\]]0402[[/\]]1: Capacitor 0402; Preference: 1; Currentie: CHF; Type: SMD; Note: To buy by assembler; Size: 0402; Footprint Acort: 0402; ROHS: True; DateLastUpdate: 2012-11-19 / 14:35:51; Manufacturer: -; Manufacturer part number: -; Package / Case: Capacitor 0402
C52 = TBD Capacitor[[/\]]0603[[/\]]1: Capacitor 0603; Preference: 1; Currentie: CHF; Type: SMD; Note: To buy by assembler; Size: 0603; Footprint Acort: 0603_G; ROHS: True; DateLastUpdate: 2012-11-19 / 14:36:40; Manufacturer: -; Manufacturer part number: -; Package / Case: Capacitor 0603
C53-C55 = TBD Capacitor[[/\]]0805[[/\]]1: Capacitor 0805; Manufacturer: TDK; Manufacturer part number: C2012X5R1V226M125AC; Preference: 1; Currentie: CHF; Type: SMD; Note: To buy by assembler; Size: 0805; Footprint Acort: 0805_G; ROHS: True; DateLastUpdate: 2012-11-19 / 14:37:26; Package / Case: Capacitor 0805
C56 = TBD Capacitor[[/\]]0805[[/\]]1: Capacitor 0805; Preference: 1; Currentie: CHF; Type: SMD; Note: To buy by assembler; Size: 0805; Footprint Acort: 0805_G; ROHS: True; DateLastUpdate: 2012-11-19 / 14:37:26; Manufacturer: -; Manufacturer part number: -; Package / Case: Capacitor 0805
P2 = 0530480350: CONN HEADER 3POS 1.25MM R/A TIN; Manufacturer: Molex; Supplier 1: Digi-Key; Stock 1: 19832; Pricing 1: 1 = 0,61000, 10 = 0,56900, 100 = 0,43590, 500 = 0,37900, 2500 = 0,28425, 5000 = 0,27478, 10000 = 0,25583 (USD); RoHS: No; Supplier Part Number 1: 0530480350-ND; Manufacturer Part Number: 0530480350
R30-R39 = TBD[[/\]]0201[[/\]]1: as R2 on sheet Main_uC; Size: 0201; Footprint Acort: 0201; ROHS: True; DateLastUpdate: 2018-10-19 / 9:06:49 AM; Type: SMD; Manufacturer: -; Manufacturer part number: -; Package / Case: Resistor 0201
U11 = MP6542A: 11A integrated 3 half-bridges for brushless motor; Manufacturer: Monolithic Power Systems; Note: Provided by Customer; Manufacturer Part Number: MP6542A; Type: SMD; Package / Case: QFN-26

## Sheet Camera_sdcard.SchDoc: Cameras and SD Card
size A4; Organization: Use Organization_Name in ProjParam; Address1: Eliot Ferragni; Address2: STI-MOBOTS; Address3: EPFL; Address4: CH-1015 LAUSANNE; DocumentNumber: 10; Revision: A; SheetNumber: 10; SheetTotal: 11; ApprovedBy: Init ApprovedBy in DocParam; CheckedBy: Init CheckedBy in DocParam; Author: Init Author in DocParam; CompanyName: Init CompanyName in DocParam; DrawnBy: Init DrawBy in DocParam; Engineer: Init Engineer in DocParam; Title2: 2 camera's connectors + micro sd card reader; DocumentName: Init DocumentName in DocParam; ProjectName: Init ProjectName in DocParam
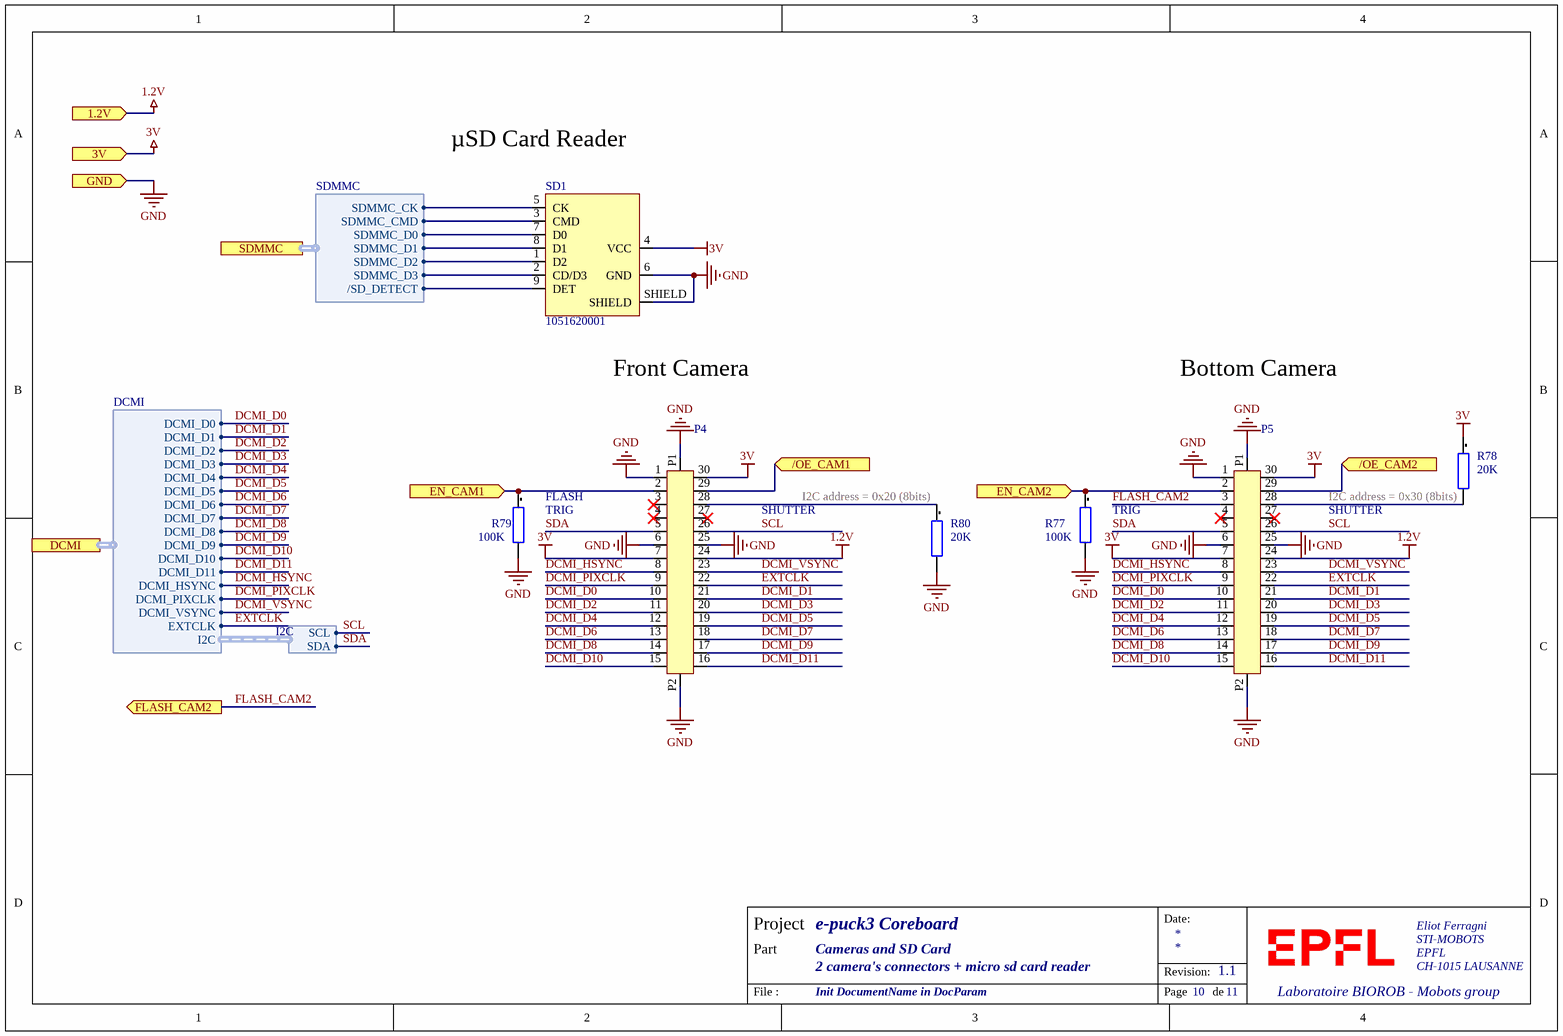
[diagram p10: Camera_sdcard.SchDoc]

### Parts
P4  HIROSE_BM23FR0.6-30DS-0.35V  [HIROSE_BM23FR0.6-30DS-0.35V]  (value not drawn)
P5  HIROSE_BM23FR0.6-30DS-0.35V  [HIROSE_BM23FR0.6-30DS-0.35V]  (value not drawn)
R77  100K  [RESC0201(0603)_L]
R78  20K  [RESC0201(0603)_L]
R79  100K  [RESC0201(0603)_L]
R80  20K  [RESC0201(0603)_L]
SD1  1051620001  [1051620001-with_card]

### Ports
1.2V (in), 3V (in), /OE_CAM1 (in), /OE_CAM2 (in), DCMI (harness DCMI), EN_CAM1 (in), EN_CAM2 (in), FLASH_CAM2 (out), GND (in), SDMMC (harness SDMMC)

### Harnesses
SDMMC: SDMMC_CK, SDMMC_CMD, SDMMC_D0, SDMMC_D1, SDMMC_D2, SDMMC_D3, /SD_DETECT
I2C: SDA, SCL
DCMI: DCMI_D0, DCMI_D1, DCMI_D2, DCMI_D3, DCMI_D4, DCMI_D5, DCMI_D6, DCMI_D7, DCMI_D8, DCMI_D9, DCMI_D10, DCMI_D11, DCMI_HSYNC, DCMI_PIXCLK, DCMI_VSYNC, I2C, EXTCLK

### Nets
1.2V: P4.24 P5.24 ; port 1.2V
3V: P4.7 P4.30 P5.7 P5.30 R78.1 SD1.4(VCC) ; port 3V
GND: P4.1 P4.6 P4.25 P4.P1 P4.P2 P5.1 P5.6 P5.25 P5.P1 P5.P2 R77.2 R79.2 R80.2 SD1.6(GND) SD1.SHIELD ; port GND
/OE_CAM1: P4.29 ; port /OE_CAM1
/OE_CAM2: P5.29 ; port /OE_CAM2
DCMI_D0: P4.10 P5.10 ; port DCMI.DCMI_D0  [project net DCMI.DCMI_D0]
DCMI_D1: P4.21 P5.21 ; port DCMI.DCMI_D1  [project net DCMI.DCMI_D1]
DCMI_D2: P4.11 P5.11 ; port DCMI.DCMI_D2  [project net DCMI.DCMI_D2]
DCMI_D3: P4.20 P5.20 ; port DCMI.DCMI_D3  [project net DCMI.DCMI_D3]
DCMI_D4: P4.12 P5.12 ; port DCMI.DCMI_D4  [project net DCMI.DCMI_D4]
DCMI_D5: P4.19 P5.19 ; port DCMI.DCMI_D5  [project net DCMI.DCMI_D5]
DCMI_D6: P4.13 P5.13 ; port DCMI.DCMI_D6  [project net DCMI.DCMI_D6]
DCMI_D7: P4.18 P5.18 ; port DCMI.DCMI_D7  [project net DCMI.DCMI_D7]
DCMI_D8: P4.14 P5.14 ; port DCMI.DCMI_D8  [project net DCMI.DCMI_D8]
DCMI_D9: P4.17 P5.17 ; port DCMI.DCMI_D9  [project net DCMI.DCMI_D9]
DCMI_D10: P4.15 P5.15 ; port DCMI.DCMI_D10  [project net DCMI.DCMI_D10]
DCMI_D11: P4.16 P5.16 ; port DCMI.DCMI_D11  [project net DCMI.DCMI_D11]
DCMI_HSYNC: P4.8 P5.8 ; port DCMI.DCMI_HSYNC  [project net DCMI.DCMI_HSYNC]
DCMI_PIXCLK: P4.9 P5.9 ; port DCMI.DCMI_PIXCLK  [project net DCMI.DCMI_PIXCLK]
DCMI_VSYNC: P4.23 P5.23 ; port DCMI.DCMI_VSYNC  [project net DCMI.DCMI_VSYNC]
EN_CAM1: P4.2 R79.1 ; port EN_CAM1
EN_CAM2: P5.2 R77.1 ; port EN_CAM2
EXTCLK: P4.22 P5.22 ; port DCMI.EXTCLK  [project net DCMI.EXTCLK]
FLASH_CAM2: P5.3 ; port FLASH_CAM2
SCL: P4.26 P5.26 ; harness I2C.SCL  [project net I2C4.SCL]
SDA: P4.5 P5.5 ; harness I2C.SDA  [project net I2C4.SDA]
SDMMC./SD_DETECT: SD1.9(DET) ; port SDMMC./SD_DETECT
SDMMC.SDMMC_CK: SD1.5(CK) ; port SDMMC.SDMMC_CK
SDMMC.SDMMC_CMD: SD1.3(CMD) ; port SDMMC.SDMMC_CMD
SDMMC.SDMMC_D0: SD1.7(D0) ; port SDMMC.SDMMC_D0
SDMMC.SDMMC_D1: SD1.8(D1) ; port SDMMC.SDMMC_D1
SDMMC.SDMMC_D2: SD1.1(D2) ; port SDMMC.SDMMC_D2
SDMMC.SDMMC_D3: SD1.2(CD/D3) ; port SDMMC.SDMMC_D3
NetP4_28: P4.28 R80.1
NetP5_28: P5.28 R78.2

Not connected (* = marked no-connect by the designer): P4 3* 4* 27*; P5 4* 27*

### Notes on the sheet
- µSD Card Reader
- Front Camera
- Bottom Camera
- (near R79) TRIG
- (near R79) FLASH
- SHUTTER
- (near R80) I2C address = 0x20 (8bits)
- (near R77) TRIG
- (near R78) I2C address = 0x30 (8bits)
- Date:
- Project
- Part
- Revision:
- File :
- Page
- de

### Library data of the parts
P4 P5 = HIROSE_BM23FR0.6-30DS-0.35V[[/\]]1: 2 x 15 Hirose header BM23FR0.6 Serie, 0.35 pitch, SMD, Mate at 0.6mm with receptacle, 0.3A signal contacts; Manufacturer part number: BM23FR0.6-30DS-0.35V(895); Preference: 1; Currentie: CHF; Note: To buy by assembler; Footprint Acort: ToDefine; ComponentLink1Description: Supplier link; ComponentLink1URL: https://www.hirose.com/product/series/BM23FR?lang=en; Supplier: Mouser; Supplier Nr: 798-3FR0630DS035V895; Manufacturer: Hirose; Manufacturer Nr: BM23FR0.6-30DS-0.35V; ROHS: True; Type: SMD; Orientation: Vertical; DateLastUpdate: 2019-09-20 / 1:27:08 PM; Quant_1: 1; Price_1: 1,19; Package / Case: Connector
R77-R80 = TBD[[/\]]0201[[/\]]1: as R2 on sheet Main_uC; Size: 0201; Footprint Acort: 0201; ROHS: True; DateLastUpdate: 2018-10-19 / 9:06:49 AM; Type: SMD; Manufacturer: -; Manufacturer part number: -; Package / Case: Resistor 0201
SD1 = 1051620001: Conn Micro SD Card HDR 8 POS 1.09mm Solder RA SMD Embossed T/R 0.5A; Manufacturer: Molex; Connector Type: Connector; Max Voltage Rating (DC): 5V; Number of Contacts: 8; Note: To buy by assembler; Supplier 1: Digi-Key; Stock 1: 20361; Pricing 1: 1 = 0,92000, 10 = 0,81300, 100 = 0,70110, 500 = 0,57360, 1000 = 0,50987 (USD); RoHS: Yes; Mount: Surface Mount; Contact Material: Bronze; Contact Plating: Gold; Housing Material: Thermoplastic; Min Operating Temperature: -40°C; Max Operating Temperature: 85°C; Packaging: Tape and Reel; Number of Rows: 1; Package Quantity: 6000; Termination: Solder; Orientation: Right Angle; Number of Circuits: 8; Length: 11.3mm; Depth: 7.6mm; Pitch: 1.09mm; Radiation Hardening: No; ComponentLink1URL: https://datasheet.ciiva.com/29723/1051620101-sd-29723393.pdf?src-supplier=Digi-Key; ComponentLink1Description: https://datasheet.ciiva.com/29723/1051620101-sd-29723393.pdf?src-supplier=Digi-Key; Supplier Part Number 1: WM14405CT-ND; Manufacturer Part Number: 1051620001; Type: SMD; Package / Case: Micro SD receptacle